# Altium schematic sheet ESP_Grow_Main_Rev_B_3.SchDoc
size A
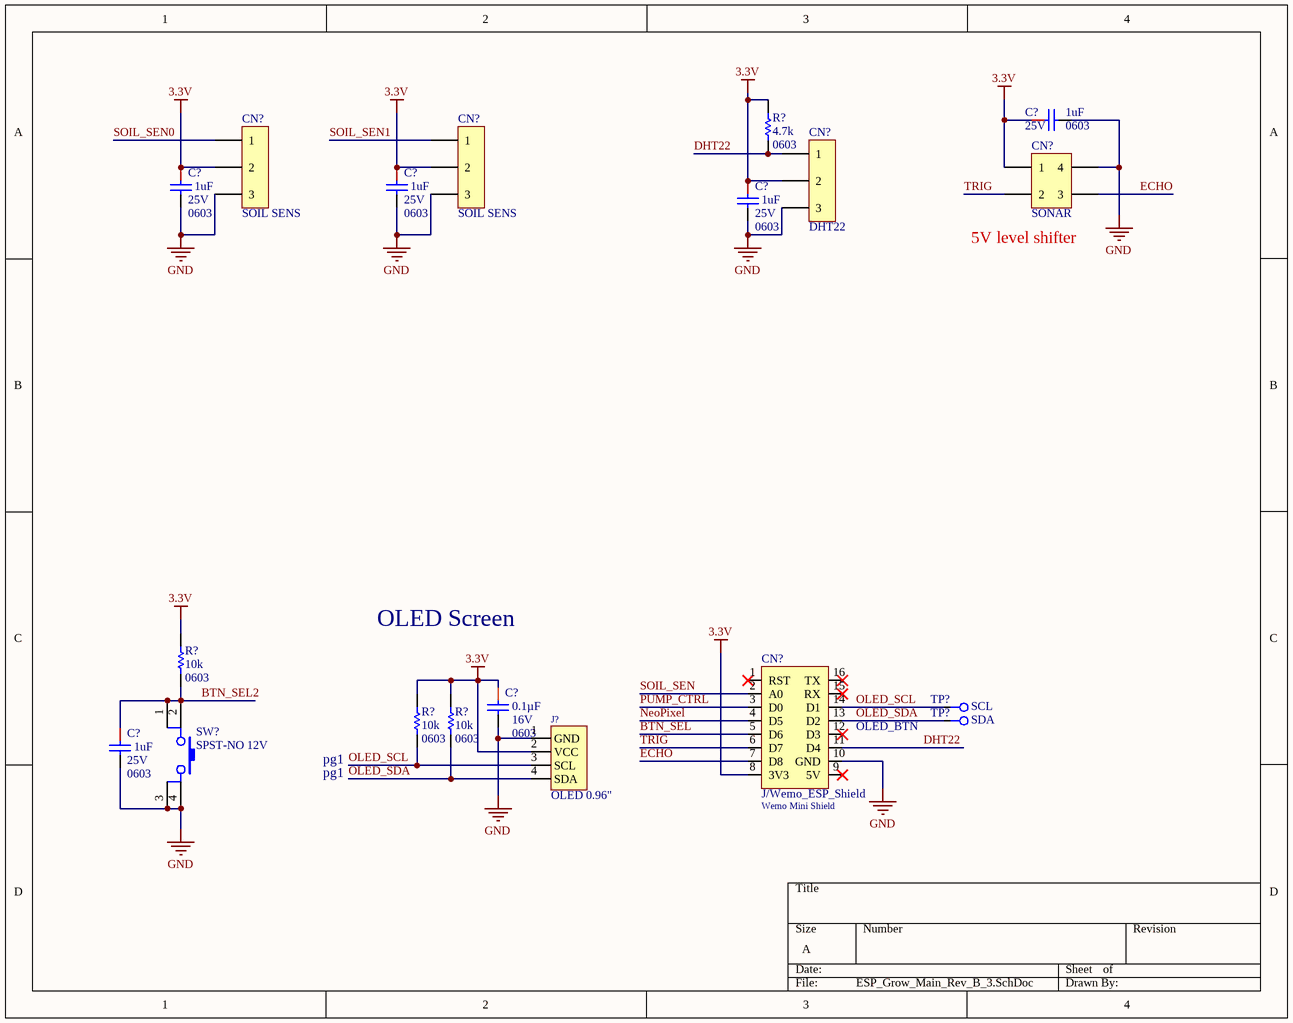
[diagram p0: ESP_Grow_Main_Rev_B_3.SchDoc]

## Parts
(Parts that share a designator on the sheet are numbered #1, #2 ... from top to bottom, then left to right.)
C?#1  1uF  Voltage - Rated: 25V  Package / Case: 0603  [CAPC0603(1608)_N]
C?#2  1uF  Voltage - Rated: 25V  Package / Case: 0603  [CAPC0603(1608)_N]
C?#3  1uF  Voltage - Rated: 25V  Package / Case: 0603  [CAPC0603(1608)_N]
C?#4  1uF  Voltage - Rated: 25V  Package / Case: 0603  [CAPC0603(1608)_N]
C?#5  Capacitance: 0.1µF  Package / Case: 0603  Voltage - Rated: 16V  [CAPC0603(1608)_L]  (hidden comment: 0.1uF)
C?#6  1uF  Voltage - Rated: 25V  Package / Case: 0603  [CAPC0603(1608)_N]
CN?#1  SOIL SENS  [Molex 1x3 Microfit 90deg]
CN?#2  SOIL SENS  [Molex 1x3 Microfit 90deg]
CN?#3  DHT22  [Molex 1x3 Microfit 90deg]
CN?#4  SONAR  [Molex 2x2 Microfit 90deg]
CN?#5  J/Wemo_ESP_Shield  Name: Wemo Mini Shield  [Wemos_d1]
J?  OLED 0.96"  [OLED_0.96_I2C-Header Only]
R?#1  Package / Case: 0603  [RESC0603(1608)_N]  (hidden comment: 4.7K)
R?#2  Resistance (Ohms): 10k  Package / Case: 0603  [RESC0603(1608)_N]  (hidden comment: 10K 1%)
R?#3  Resistance (Ohms): 10k  Package / Case: 0603  [RESC0603(1608)_L]  (hidden comment: 10K 1%)
R?#4  Resistance (Ohms): 10k  Package / Case: 0603  [RESC0603(1608)_L]  (hidden comment: 10K 1%)
SW?  SPST-NO 12V  [SW TACT Red 6mm x 6mm]
TP?#1  SCL  [Pogo-Testpoint]  (no BOM)
TP?#2  SDA  [Pogo-Testpoint]  (no BOM)

## Nets
3.3V: C?#1.1 C?#2.1 C?#3.1 C?#4.1 C?#5.1 CN?#1.2 CN?#2.2 CN?#3.2 CN?#4.1 CN?#5.8(3V3) J?.2(VCC) R?#1.2 R?#2.2 R?#3.2 R?#4.2
GND: C?#1.2 C?#2.2 C?#3.2 C?#4.2 C?#5.2 C?#6.2 CN?#1.3 CN?#2.3 CN?#3.3 CN?#4.4 CN?#5.10(GND) J?.1(GND) SW?.3 SW?.4
BTN_SEL: CN?#5.5(D6)
BTN_SEL2: C?#6.1 R?#2.1 SW?.1 SW?.2
DHT22: CN?#3.1 CN?#5.11(D4) R?#1.1
ECHO: CN?#4.3 CN?#5.7(D8)
NeoPixel: CN?#5.4(D5)
OLED_SCL: CN?#5.14(D1) J?.3(SCL) R?#3.1 TP?#1.1
OLED_SDA: CN?#5.13(D2) J?.4(SDA) R?#4.1 TP?#2.1
PUMP_CTRL: CN?#5.3(D0)
SOIL_SEN: CN?#5.2(A0)
SOIL_SEN0: CN?#1.1
SOIL_SEN1: CN?#2.1
TRIG: CN?#4.2 CN?#5.6(D7)

Not connected (* = marked no-connect by the designer): CN?#5 1(RST)* 9(5V)* 12(D3)* 15(RX)* 16(TX)*

## Notes on the sheet
- (near CN?#4) 5V level shifter
- OLED Screen
- pg1
- (near CN?#5) OLED_BTN

## Library data of the parts
C?#1-C?#4 C?#6 = CAP CER 1UF 25V 10% X7R 0603: 1uF 0603 25V; Manufacturer: TDK Corporation; Manufacturer Part Number: CGA3E1X7R1E105K080AC; Tolerance: ±10%; Temperature Coefficient: X7R; Supplier 1: Digi-Key; RoHS: RoHS Compliant; Category: Capacitors; Stock 1: 360610; Pricing 1: 1=0.2, 10=0.135, 100=0.0686, 500=0.04696, 1000=0.04154 (USD); Packaging: Cut Tape (CT); Part Status: Active; Operating Temperature: -55°C ~ 125°C; Features: -; Ratings: AEC-Q200; Applications: Automotive; Failure Rate: -; Mounting Type: Surface Mount, MLCC; Size / Dimension: 0.063" L x 0.032" W (1.60mm x 0.80mm); Height - Seated (Max): -; Thickness (Max): 0.035" (0.90mm); Lead Spacing: -; Lead Style: -; ComponentLink1URL: https://product.tdk.com/info/en/catalog/datasheets/mlcc_automotive_general_en.pdf; ComponentLink1Description: https://product.tdk.com/info/en/catalog/datasheets/mlcc_automotive_general_en.pdf; Supplier Part Number 1: 445-6931-1-ND
C?#5 = CAP CER 0.1UF 16V 10% X7R 0603: 0.1uF 0603 16V; Manufacturer: Kemet; Manufacturer Part Number: C0603C104K4RACTU; Tolerance: ±10%; Temperature Coefficient: X7R; Supplier 1: Digi-Key; RoHS: RoHS Compliant; Category: Capacitors; Stock 1: 2360000; Pricing 1: 4000=0.00414, 8000=0.00378, 12000=0.0036, 28000=0.00342, 100000=0.00248 (USD); Packaging: Tape & Reel (TR); Mounting Type: Surface Mount, MLCC; Operating Temperature: -55°C ~ 125°C; Applications: General Purpose; Ratings: -; Size / Dimension: 0.063" L x 0.031" W (1.60mm x 0.80mm); Height - Seated (Max): -; Thickness (Max): 0.034" (0.87mm); Lead Spacing: -; Features: -; Lead Style: -; ComponentLink1URL: http://www.kemet.com/datasheets&C0603C104K4RACTU; ComponentLink1Description: http://www.kemet.com/datasheets&C0603C104K4RACTU; Supplier Part Number 1: 399-1096-2-ND
CN?#1-CN?#3 = MICROFIT 3.0 HDR 90deg 3CKT: Molex Microfit 1x3 90deg Header; Manufacturer: Molex Inc; Manufacturer Part Number: 0436500304; Connector Type: Header, Shrouded; Number of Positions: 3; Number of Positions Loaded: All; Pitch: 0.118" (3.00mm); ClassName: *; Supplier 1: Digi-Key; RoHS: RoHS Compliant; Category: Connectors, Interconnects; Stock 1: 42564; Pricing 1: 1=1.39, 10=1.224, 50=1.104, 100=1.056, 250=0.96, 500=0.864, 1000=0.768, 2500=0.696, 5000=0.672 (USD); Packaging: Tray; Contact Type: Male Pin; Number of Rows: 1; Row Spacing: -; Contact Mating Length: -; Mounting Type: Through Hole, Right Angle; Termination: Solder; Fastening Type: Locking Ramp; Features: Board Lock; Contact Finish: Gold; Contact Finish Thickness: 15µin (0.38µm); Color: Black; ComponentLink1URL: http://www.molex.com/pdm_docs/sd/436500304_sd.pdf; ComponentLink1Description: http://www.molex.com/pdm_docs/sd/436500304_sd.pdf; Supplier Part Number 1: WM1876-ND
CN?#4 = MICROFIT 3.0 HDR 90deg 4CKT: Molex Microfit 2x2 90deg Header; Manufacturer: Molex Inc; Manufacturer Part Number: 0430450400; Connector Type: Header, Shrouded; Number of Positions: 4; Number of Positions Loaded: All; Pitch: 0.118" (3.00mm); ClassName: *; Supplier 1: Digi-Key; RoHS: RoHS Compliant; Category: Connectors, Interconnects; Stock 1: 9668; Pricing 1: 1=1.35, 10=1.228, 50=1.1026, 100=1.0525, 250=0.95228, 500=0.8771, 1000=0.7518, 2500=0.70168, 5000=0.6666 (USD); Packaging: Tray; Contact Type: Male Pin; Number of Rows: 2; Row Spacing: 0.118" (3.00mm); Contact Mating Length: -; Mounting Type: Through Hole, Right Angle; Termination: Solder; Fastening Type: Locking Ramp; Features: Board Lock; Contact Finish: Tin; Contact Finish Thickness: 100µin (2.54µm); Color: Black; ComponentLink1URL: http://www.molex.com/pdm_docs/sd/430450400_sd.pdf; ComponentLink1Description: http://www.molex.com/pdm_docs/sd/430450400_sd.pdf; Supplier Part Number 1: WM1814-ND
CN?#5 = J/Wemo_ESP_Shield: Wemo Mini Shield for ESP-12
J? = OLED_0.96_I2C: SSD1306 I2C OLED 0.96"
R?#1 = RES 4.7K OHM 1/10W 5% 0603 SMD: 4.7K 0603; Manufacturer: Panasonic Electronic Components; Manufacturer Part Number: ERJ-3GEYJ472V; Tolerance: ±5%; Power (Watts): 0.1W, 1/10W; Temperature Coefficient: ±200ppm/°C; Supplier 1: Digi-Key; RoHS: RoHS Compliant; Category: Resistors; Stock 1: 1261582; Pricing 1: 1=0.1, 50=0.0126, 100=0.0096, 250=0.00716, 500=0.00528, 1000=0.00352, 2500=0.00297 (USD); Packaging: Cut Tape (CT); Resistance (Ohms): 4.7k; Composition: Thick Film; Features: Automotive AEC-Q200 Qualified; Supplier Device Package: 0603; Size / Dimension: 0.063" L x 0.031" W (1.60mm x 0.80mm); Height: 0.022" (0.55mm); Number of Terminations: 2; ComponentLink1URL: http://industrial.panasonic.com/www-cgi/jvcr13pz.cgi?E+PZ+3+AOA0001+ERJ3GEYJ472V+7+WW; ComponentLink1Description: http://industrial.panasonic.com/www-cgi/jvcr13pz.cgi?E+PZ+3+AOA0001+ERJ3GEYJ472V+7+WW; Supplier Part Number 1: P4.7KGCT-ND
R?#2-R?#4 = RES 10K OHM 1/10W 1% 0603 SMD: 10K 0603; Manufacturer: Panasonic Electronic Components; Manufacturer Part Number: ERJ-3EKF1002V; Power (Watts): 0.1W, 1/10W; Temperature Coefficient: ±100ppm/°C; Category: Resistors; Supplier 1: Digi-Key; RoHS: RoHS Compliant; Stock 1: 5046430; Pricing 1: 1=0.1, 50=0.015, 100=0.0114, 250=0.00844, 500=0.00624, 1000=0.00416, 2500=0.00351 (USD); Packaging: Cut Tape (CT); Tolerance: ±1%; Composition: Thick Film; Features: -; Supplier Device Package: 0603; Size / Dimension: 0.063" L x 0.031" W (1.60mm x 0.80mm); Height: 0.022" (0.55mm); Number of Terminations: 2; ComponentLink1URL: http://industrial.panasonic.com/www-cgi/jvcr13pz.cgi?E+PZ+3+AOA0002+ERJ3EKF1002V+7+WW; ComponentLink1Description: http://industrial.panasonic.com/www-cgi/jvcr13pz.cgi?E+PZ+3+AOA0002+ERJ3EKF1002V+7+WW; Supplier Part Number 1: P10.0KHCT-ND
SW? = PTS645SM43SMTR92 LFS: SWITCH TACTILE SPST-NO 0.05A 12V; Manufacturer: C&K; Switch Function: Off-Mom; Contact Rating @ Voltage: 0.05A @ 12VDC; Actuator Type: Standard; Actuator Height off PCB, Vertical: 4.30mm; Actuator Orientation: Top Actuated; Outline: 6.00mm x 6.00mm; Illumination: Non-Illuminated; Operating Force: 160gf; Actuator Material: Polyamide (PA66), Nylon 6/6; Mechanical Life: 100,000 Cycles; ClassName: *; Supplier 1: Digi-Key; Manufacturer Part Number: PTS645SM43SMTR92 LFS; RoHS: RoHS Compliant; Category: Switches; Stock 1: 234699; Pricing 1: 1=0.15, 10=0.147, 25=0.1416, 50=0.1366, 100=0.129, 250=0.12144, 500=0.11638 (USD); Packaging: Cut Tape (CT); Part Status: Active; Circuit: SPST-NO; Mounting Type: Surface Mount; Actuator Length, Right Angle: -; Termination Style: Gull Wing; Illumination Type, Color: -; Illumination Voltage (Nominal): -; Ingress Protection: -; Features: Blue Actuator; Switch Travel: -; Operating Temperature: -20°C ~ 60°C; ComponentLink1URL: http://www.ckswitches.com/media/1471/pts645.pdf; ComponentLink1Description: http://www.ckswitches.com/media/1471/pts645.pdf; Supplier Part Number 1: CKN9112CT-ND
TP?#1 TP?#2 = CMP-001-0557-03: Test Point- Current one; Pin Count: 1; Component Name: TestPoint; Designator: TestPoint